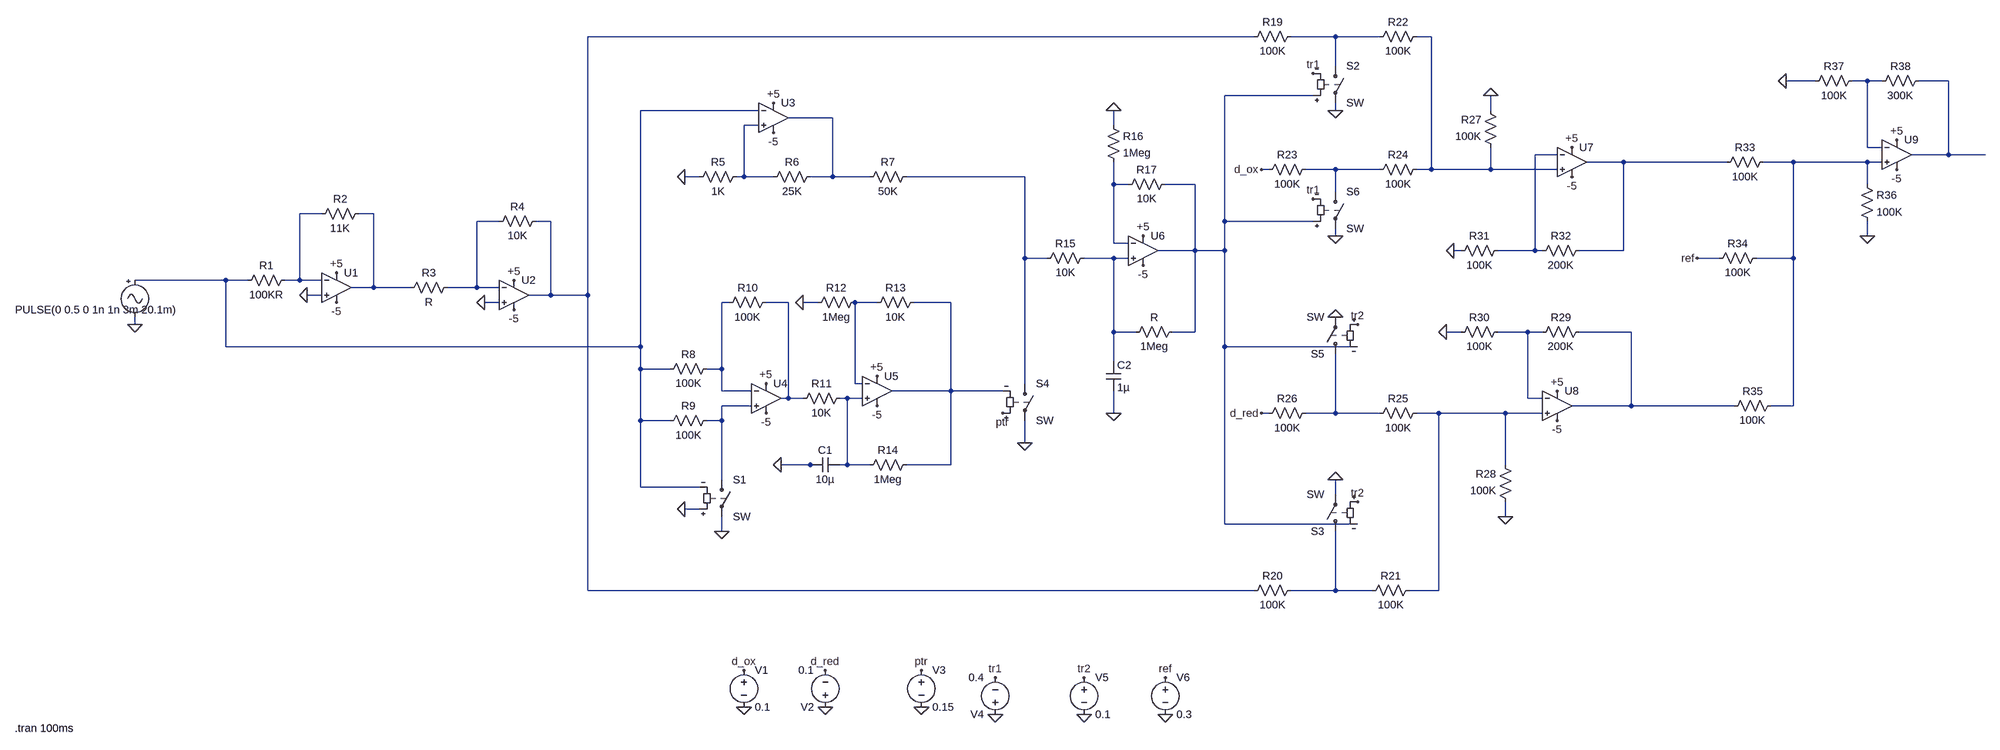
[diagram p0: schematic splitter.asc]
splitter.asc, the LTspice schematic file:
Version 4
SHEET 1 3940 1396
WIRE 2288 -400 688 -400
WIRE 2464 -400 2368 -400
WIRE 2560 -400 2464 -400
WIRE 2672 -400 2640 -400
WIRE 2464 -336 2464 -400
WIRE 3568 -304 3504 -304
WIRE 3680 -304 3648 -304
WIRE 3712 -304 3680 -304
WIRE 3856 -304 3792 -304
WIRE 2416 -272 2224 -272
WIRE 1216 -240 960 -240
WIRE 2464 -240 2464 -256
WIRE 2800 -240 2800 -272
WIRE 1376 -224 1280 -224
WIRE 1216 -208 1184 -208
WIRE 1984 -208 1984 -240
WIRE 3680 -160 3680 -304
WIRE 3712 -160 3680 -160
WIRE 2944 -144 2896 -144
WIRE 3856 -144 3856 -304
WIRE 3856 -144 3776 -144
WIRE 3936 -144 3856 -144
WIRE 3088 -128 3008 -128
WIRE 3376 -128 3088 -128
WIRE 3520 -128 3456 -128
WIRE 3680 -128 3520 -128
WIRE 3712 -128 3680 -128
WIRE 2320 -112 2304 -112
WIRE 2464 -112 2400 -112
WIRE 2560 -112 2464 -112
WIRE 2672 -112 2672 -400
WIRE 2672 -112 2640 -112
WIRE 2800 -112 2800 -160
WIRE 2800 -112 2672 -112
WIRE 2944 -112 2800 -112
WIRE 1088 -96 1056 -96
WIRE 1184 -96 1184 -208
WIRE 1184 -96 1168 -96
WIRE 1248 -96 1184 -96
WIRE 1376 -96 1376 -224
WIRE 1376 -96 1328 -96
WIRE 1456 -96 1376 -96
WIRE 1792 -96 1536 -96
WIRE 1984 -80 1984 -128
WIRE 2016 -80 1984 -80
WIRE 2160 -80 2096 -80
WIRE 3680 -80 3680 -128
WIRE 2464 -64 2464 -112
WIRE 112 -16 64 -16
WIRE 224 -16 192 -16
WIRE 496 0 448 0
WIRE 608 0 576 0
WIRE 2224 0 2224 -272
WIRE 2416 0 2224 0
WIRE 2464 32 2464 16
WIRE 3680 32 3680 0
WIRE 1984 48 1984 -80
WIRE 2016 48 1984 48
WIRE 2160 64 2160 -80
WIRE 2160 64 2080 64
WIRE 2224 64 2224 0
WIRE 2224 64 2160 64
WIRE 2736 64 2720 64
WIRE 2896 64 2896 -144
WIRE 2896 64 2816 64
WIRE 2912 64 2896 64
WIRE 3088 64 3088 -128
WIRE 3088 64 2992 64
WIRE 1792 80 1792 -96
WIRE 1840 80 1792 80
WIRE 1984 80 1920 80
WIRE 2016 80 1984 80
WIRE 3360 80 3312 80
WIRE 3520 80 3520 -128
WIRE 3520 80 3440 80
WIRE -96 128 -384 128
WIRE -48 128 -96 128
WIRE 64 128 64 -16
WIRE 64 128 32 128
WIRE 112 128 64 128
WIRE 224 144 224 -16
WIRE 224 144 176 144
WIRE 304 144 224 144
WIRE 448 144 448 0
WIRE 448 144 384 144
WIRE 496 144 448 144
WIRE 112 160 80 160
WIRE 608 160 608 0
WIRE 608 160 560 160
WIRE 688 160 688 -400
WIRE 688 160 608 160
WIRE 496 176 464 176
WIRE 1152 176 1136 176
WIRE 1280 176 1232 176
WIRE 1344 176 1312 176
WIRE 1472 176 1424 176
WIRE 1632 176 1552 176
WIRE -384 224 -384 208
WIRE 1984 240 1984 80
WIRE 2032 240 1984 240
WIRE 2160 240 2160 64
WIRE 2160 240 2112 240
WIRE 2736 240 2704 240
WIRE 2880 240 2816 240
WIRE 2912 240 2880 240
WIRE 3104 240 2992 240
WIRE -96 272 -96 128
WIRE 960 272 960 -240
WIRE 960 272 -96 272
WIRE 2224 272 2224 64
WIRE 2512 272 2224 272
WIRE 1984 304 1984 240
WIRE 960 320 960 272
WIRE 1024 320 960 320
WIRE 1136 320 1136 176
WIRE 1136 320 1104 320
WIRE 1424 352 1424 176
WIRE 1440 352 1424 352
WIRE 1792 352 1792 80
WIRE 1136 368 1136 320
WIRE 1200 368 1136 368
WIRE 1632 368 1632 176
WIRE 1632 368 1504 368
WIRE 1744 368 1632 368
WIRE 1280 384 1280 176
WIRE 1280 384 1264 384
WIRE 1312 384 1280 384
WIRE 1408 384 1392 384
WIRE 1440 384 1408 384
WIRE 2880 384 2880 240
WIRE 2912 384 2880 384
WIRE 1200 400 1136 400
WIRE 3104 400 3104 240
WIRE 3104 400 2976 400
WIRE 3392 400 3104 400
WIRE 3520 400 3520 80
WIRE 3520 400 3472 400
WIRE 1984 416 1984 368
WIRE 2320 416 2304 416
WIRE 2464 416 2464 288
WIRE 2464 416 2400 416
WIRE 2560 416 2464 416
WIRE 2688 416 2640 416
WIRE 2832 416 2688 416
WIRE 2912 416 2832 416
WIRE 960 432 960 320
WIRE 1024 432 960 432
WIRE 1136 432 1136 400
WIRE 1136 432 1104 432
WIRE 1792 480 1792 432
WIRE 1328 528 1264 528
WIRE 1344 528 1328 528
WIRE 1408 528 1408 384
WIRE 1408 528 1392 528
WIRE 1456 528 1408 528
WIRE 1632 528 1632 368
WIRE 1632 528 1536 528
WIRE 2832 528 2832 416
WIRE 1136 560 1136 432
WIRE 960 576 960 432
WIRE 1088 576 960 576
WIRE 2464 592 2464 560
WIRE 1088 624 1056 624
WIRE 2832 640 2832 608
WIRE 2224 656 2224 272
WIRE 2512 656 2224 656
WIRE 1136 672 1136 640
WIRE 688 800 688 160
WIRE 2288 800 688 800
WIRE 2464 800 2464 672
WIRE 2464 800 2368 800
WIRE 2544 800 2464 800
WIRE 2688 800 2688 416
WIRE 2688 800 2624 800
FLAG 144 112 +5
FLAG 144 176 -5
FLAG 80 160 0
FLAG 528 128 +5
FLAG 528 192 -5
FLAG 464 176 0
FLAG 1248 -256 +5
FLAG 1248 -192 -5
FLAG 1056 -96 0
FLAG 1232 352 +5
FLAG 1232 416 -5
FLAG 1472 336 +5
FLAG 1472 400 -5
FLAG 1312 176 0
FLAG 1264 528 0
FLAG 2048 32 +5
FLAG 2048 96 -5
FLAG 1984 416 0
FLAG 1984 -240 0
FLAG 1056 624 0
FLAG 1136 672 0
FLAG 2464 -240 0
FLAG 2464 560 0
FLAG 1792 480 0
FLAG 2832 640 0
FLAG 2464 208 0
FLAG 2464 32 0
FLAG 2800 -272 0
FLAG 2976 -160 +5
FLAG 2976 -96 -5
FLAG 2944 368 +5
FLAG 2944 432 -5
FLAG 2720 64 0
FLAG 2704 240 0
FLAG 3744 -176 +5
FLAG 3744 -112 -5
FLAG 3680 32 0
FLAG 3504 -304 0
FLAG 1184 1328 0
FLAG 1184 1248 d_ox
FLAG 1360 1328 0
FLAG 1360 1248 d_red
FLAG 1568 1328 0
FLAG 1568 1248 ptr
FLAG 1728 1344 0
FLAG 1728 1264 tr1
FLAG 1920 1344 0
FLAG 1920 1264 tr2
FLAG 2096 1344 0
FLAG 2096 1264 ref
FLAG 1744 416 ptr
FLAG 2512 608 tr2
FLAG 2304 416 d_red
FLAG 2512 224 tr2
FLAG 2416 -48 tr1
FLAG 2304 -112 d_ox
FLAG 2416 -320 tr1
FLAG 3312 80 ref
FLAG -384 224 0
SYMBOL res 48 112 R90
WINDOW 0 0 56 VBottom 2
WINDOW 3 32 56 VTop 2
SYMATTR InstName R1
SYMATTR Value 100KR
SYMBOL Opamps\\UniversalOpamp2 144 144 R0
SYMATTR InstName U1
SYMBOL res 208 -32 R90
WINDOW 0 0 56 VBottom 2
WINDOW 3 32 56 VTop 2
SYMATTR InstName R2
SYMATTR Value 11K
SYMBOL res 400 128 R90
WINDOW 0 0 56 VBottom 2
WINDOW 3 32 56 VTop 2
SYMATTR InstName R3
SYMBOL Opamps\\UniversalOpamp2 528 160 R0
SYMATTR InstName U2
SYMBOL res 592 -16 R90
WINDOW 0 0 56 VBottom 2
WINDOW 3 32 56 VTop 2
SYMATTR InstName R4
SYMATTR Value 10K
SYMBOL Opamps\\UniversalOpamp2 1248 -224 R0
SYMATTR InstName U3
SYMBOL res 1184 -112 R90
WINDOW 0 0 56 VBottom 2
WINDOW 3 32 56 VTop 2
SYMATTR InstName R5
SYMATTR Value 1K
SYMBOL res 1344 -112 R90
WINDOW 0 0 56 VBottom 2
WINDOW 3 32 56 VTop 2
SYMATTR InstName R6
SYMATTR Value 25K
SYMBOL res 1552 -112 R90
WINDOW 0 0 56 VBottom 2
WINDOW 3 32 56 VTop 2
SYMATTR InstName R7
SYMATTR Value 50K
SYMBOL res 1120 304 R90
WINDOW 0 0 56 VBottom 2
WINDOW 3 32 56 VTop 2
SYMATTR InstName R8
SYMATTR Value 100K
SYMBOL res 1120 416 R90
WINDOW 0 0 56 VBottom 2
WINDOW 3 32 56 VTop 2
SYMATTR InstName R9
SYMATTR Value 100K
SYMBOL res 1248 160 R90
WINDOW 0 0 56 VBottom 2
WINDOW 3 32 56 VTop 2
SYMATTR InstName R10
SYMATTR Value 100K
SYMBOL res 1408 368 R90
WINDOW 0 0 56 VBottom 2
WINDOW 3 32 56 VTop 2
SYMATTR InstName R11
SYMATTR Value 10K
SYMBOL Opamps\\UniversalOpamp2 1232 384 R0
SYMATTR InstName U4
SYMBOL Opamps\\UniversalOpamp2 1472 368 R0
SYMATTR InstName U5
SYMBOL res 1440 160 R90
WINDOW 0 0 56 VBottom 2
WINDOW 3 32 56 VTop 2
SYMATTR InstName R12
SYMATTR Value 1Meg
SYMBOL res 1568 160 R90
WINDOW 0 0 56 VBottom 2
WINDOW 3 32 56 VTop 2
SYMATTR InstName R13
SYMATTR Value 10K
SYMBOL res 1552 512 R90
WINDOW 0 0 56 VBottom 2
WINDOW 3 32 56 VTop 2
SYMATTR InstName R14
SYMATTR Value 1Meg
SYMBOL cap 1392 512 R90
WINDOW 0 0 32 VBottom 2
WINDOW 3 32 32 VTop 2
SYMATTR InstName C1
SYMATTR Value 10µ
SYMBOL res 1936 64 R90
WINDOW 0 0 56 VBottom 2
WINDOW 3 32 56 VTop 2
SYMATTR InstName R15
SYMATTR Value 10K
SYMBOL Opamps\\UniversalOpamp2 2048 64 R0
SYMATTR InstName U6
SYMBOL res 1968 -224 R0
SYMATTR InstName R16
SYMATTR Value 1Meg
SYMBOL res 2112 -96 R90
WINDOW 0 0 56 VBottom 2
WINDOW 3 32 56 VTop 2
SYMATTR InstName R17
SYMATTR Value 10K
SYMBOL res 2128 224 R90
WINDOW 0 0 56 VBottom 2
WINDOW 3 32 56 VTop 2
SYMATTR InstName R
SYMATTR Value 1Meg
SYMBOL cap 1968 304 R0
SYMATTR InstName C2
SYMATTR Value 1µ
SYMBOL sw 1136 544 R0
SYMATTR InstName S1
SYMBOL res 2384 -416 R90
WINDOW 0 0 56 VBottom 2
WINDOW 3 32 56 VTop 2
SYMATTR InstName R19
SYMATTR Value 100K
SYMBOL res 2384 784 R90
WINDOW 0 0 56 VBottom 2
WINDOW 3 32 56 VTop 2
SYMATTR InstName R20
SYMATTR Value 100K
SYMBOL res 2640 784 R90
WINDOW 0 0 56 VBottom 2
WINDOW 3 32 56 VTop 2
SYMATTR InstName R21
SYMATTR Value 100K
SYMBOL res 2656 -416 R90
WINDOW 0 0 56 VBottom 2
WINDOW 3 32 56 VTop 2
SYMATTR InstName R22
SYMATTR Value 100K
SYMBOL sw 2464 -352 R0
SYMATTR InstName S2
SYMBOL sw 2464 688 R180
SYMATTR InstName S3
SYMBOL res 2416 -128 R90
WINDOW 0 0 56 VBottom 2
WINDOW 3 32 56 VTop 2
SYMATTR InstName R23
SYMATTR Value 100K
SYMBOL sw 1792 336 R0
SYMATTR InstName S4
SYMBOL sw 2464 304 R180
SYMATTR InstName S5
SYMBOL sw 2464 -80 R0
SYMATTR InstName S6
SYMBOL res 2656 -128 R90
WINDOW 0 0 56 VBottom 2
WINDOW 3 32 56 VTop 2
SYMATTR InstName R24
SYMATTR Value 100K
SYMBOL res 2656 400 R90
WINDOW 0 0 56 VBottom 2
WINDOW 3 32 56 VTop 2
SYMATTR InstName R25
SYMATTR Value 100K
SYMBOL res 2416 400 R90
WINDOW 0 0 56 VBottom 2
WINDOW 3 32 56 VTop 2
SYMATTR InstName R26
SYMATTR Value 100K
SYMBOL res 2816 -144 R180
WINDOW 0 36 76 Left 2
WINDOW 3 36 40 Left 2
SYMATTR InstName R27
SYMATTR Value 100K
SYMBOL res 2848 624 R180
WINDOW 0 36 76 Left 2
WINDOW 3 36 40 Left 2
SYMATTR InstName R28
SYMATTR Value 100K
SYMBOL Opamps\\UniversalOpamp2 2976 -128 R0
SYMATTR InstName U7
SYMBOL Opamps\\UniversalOpamp2 2944 400 R0
SYMATTR InstName U8
SYMBOL res 3008 224 R90
WINDOW 0 0 56 VBottom 2
WINDOW 3 32 56 VTop 2
SYMATTR InstName R29
SYMATTR Value 200K
SYMBOL res 2832 224 R90
WINDOW 0 0 56 VBottom 2
WINDOW 3 32 56 VTop 2
SYMATTR InstName R30
SYMATTR Value 100K
SYMBOL res 2832 48 R90
WINDOW 0 0 56 VBottom 2
WINDOW 3 32 56 VTop 2
SYMATTR InstName R31
SYMATTR Value 100K
SYMBOL res 3008 48 R90
WINDOW 0 0 56 VBottom 2
WINDOW 3 32 56 VTop 2
SYMATTR InstName R32
SYMATTR Value 200K
SYMBOL res 3472 -144 R90
WINDOW 0 0 56 VBottom 2
WINDOW 3 32 56 VTop 2
SYMATTR InstName R33
SYMATTR Value 100K
SYMBOL res 3456 64 R90
WINDOW 0 0 56 VBottom 2
WINDOW 3 32 56 VTop 2
SYMATTR InstName R34
SYMATTR Value 100K
SYMBOL res 3488 384 R90
WINDOW 0 0 56 VBottom 2
WINDOW 3 32 56 VTop 2
SYMATTR InstName R35
SYMATTR Value 100K
SYMBOL Opamps\\UniversalOpamp2 3744 -144 R0
SYMATTR InstName U9
SYMBOL res 3664 -96 R0
SYMATTR InstName R36
SYMATTR Value 100K
SYMBOL res 3664 -320 R90
WINDOW 0 0 56 VBottom 2
WINDOW 3 32 56 VTop 2
SYMATTR InstName R37
SYMATTR Value 100K
SYMBOL res 3808 -320 R90
WINDOW 0 0 56 VBottom 2
WINDOW 3 32 56 VTop 2
SYMATTR InstName R38
SYMATTR Value 300K
SYMBOL voltage 1184 1232 R0
WINDOW 123 0 0 Left 0
WINDOW 39 0 0 Left 0
SYMATTR InstName V1
SYMATTR Value 0.1
SYMBOL voltage 1360 1344 R180
WINDOW 123 0 0 Left 0
WINDOW 39 0 0 Left 0
SYMATTR InstName V2
SYMATTR Value 0.1
SYMBOL voltage 1568 1232 R0
WINDOW 123 0 0 Left 0
WINDOW 39 0 0 Left 0
SYMATTR InstName V3
SYMATTR Value 0.15
SYMBOL voltage 1728 1360 R180
WINDOW 123 0 0 Left 0
WINDOW 39 0 0 Left 0
SYMATTR InstName V4
SYMATTR Value 0.4
SYMBOL voltage 1920 1248 R0
WINDOW 123 0 0 Left 0
WINDOW 39 0 0 Left 0
SYMATTR InstName V5
SYMATTR Value 0.1
SYMBOL voltage 2096 1248 R0
WINDOW 123 0 0 Left 0
WINDOW 39 0 0 Left 0
SYMATTR InstName V6
SYMATTR Value 0.3
SYMBOL Misc\\signal -384 112 R0
WINDOW 0 24 16 Invisible 2
WINDOW 3 -259 80 Left 2
WINDOW 123 0 0 Left 2
WINDOW 39 0 0 Left 2
SYMATTR InstName V7
SYMATTR Value PULSE(0 0.5 0 1n 1n 3m 20.1m)
TEXT -644 1374 Left 2 !.tran 100ms

The netlist it stands for:
* splitter.asc
R1 N016 N007 100KR
XU1 0 N016 +5 -5 N017 level.2 Avol=1Meg GBW=10Meg Slew=10Meg ilimit=25m rail=0 Vos=0 phimargin=45 en=0 enk=0 in=0 ink=0 Rin=500Meg  ; pins IN+ IN- V+ V- OUT
R2 N017 N016 11K
R3 N018 N017 R
XU2 0 N018 +5 -5 N001 level.2 Avol=1Meg GBW=10Meg Slew=10Meg ilimit=25m rail=0 Vos=0 phimargin=45 en=0 enk=0 in=0 ink=0 Rin=500Meg  ; pins IN+ IN- V+ V- OUT
R4 N001 N018 10K
XU3 N009 N007 +5 -5 N008 level.2 Avol=1Meg GBW=10Meg Slew=10Meg ilimit=25m rail=0 Vos=0 phimargin=45 en=0 enk=0 in=0 ink=0 Rin=500Meg  ; pins IN+ IN- V+ V- OUT
R5 N009 0 1K
R6 N008 N009 25K
R7 N014 N008 50K
R8 N020 N007 100K
R9 N027 N007 100K
R10 N021 N020 100K
R11 N026 N021 10K
XU4 N027 N020 +5 -5 N021 level.2 Avol=1Meg GBW=10Meg Slew=10Meg ilimit=25m rail=0 Vos=0 phimargin=45 en=0 enk=0 in=0 ink=0 Rin=500Meg  ; pins IN+ IN- V+ V- OUT
XU5 N026 N022 +5 -5 N023 level.2 Avol=1Meg GBW=10Meg Slew=10Meg ilimit=25m rail=0 Vos=0 phimargin=45 en=0 enk=0 in=0 ink=0 Rin=500Meg  ; pins IN+ IN- V+ V- OUT
R12 N022 0 1Meg
R13 N023 N022 10K
R14 N023 N026 1Meg
C1 N026 0 10µ
R15 N019 N014 10K
XU6 N019 N015 +5 -5 N006 level.2 Avol=1Meg GBW=10Meg Slew=10Meg ilimit=25m rail=0 Vos=0 phimargin=45 en=0 enk=0 in=0 ink=0 Rin=500Meg  ; pins IN+ IN- V+ V- OUT
R16 0 N015 1Meg
R17 N006 N015 10K
R N006 N019 1Meg
C2 N019 0 1µ
S1 N027 0 0 N007 SW
R19 N002 N001 100K
R20 N030 N001 100K
R21 N029 N030 100K
R22 N003 N002 100K
S2 N002 0 N006 tr1 SW
S3 N030 0 tr2 N006 SW
R23 N013 d_ox 100K
S4 N014 0 ptr N023 SW
S5 N028 0 tr2 N006 SW
S6 N013 0 N006 tr1 SW
R24 N003 N013 100K
R25 N029 N028 100K
R26 N028 d_red 100K
R27 N003 0 100K
R28 0 N029 100K
XU7 N003 N010 +5 -5 N011 level.2 Avol=1Meg GBW=10Meg Slew=10Meg ilimit=25m rail=0 Vos=0 phimargin=45 en=0 enk=0 in=0 ink=0 Rin=500Meg  ; pins IN+ IN- V+ V- OUT
XU8 N029 N024 +5 -5 N025 level.2 Avol=1Meg GBW=10Meg Slew=10Meg ilimit=25m rail=0 Vos=0 phimargin=45 en=0 enk=0 in=0 ink=0 Rin=500Meg  ; pins IN+ IN- V+ V- OUT
R29 N025 N024 200K
R30 N024 0 100K
R31 N010 0 100K
R32 N011 N010 200K
R33 N012 N011 100K
R34 N012 ref 100K
R35 N012 N025 100K
XU9 N012 N004 +5 -5 N005 level.2 Avol=1Meg GBW=10Meg Slew=10Meg ilimit=25m rail=0 Vos=0 phimargin=45 en=0 enk=0 in=0 ink=0 Rin=500Meg  ; pins IN+ IN- V+ V- OUT
R36 N012 0 100K
R37 N004 0 100K
R38 N005 N004 300K
V1 d_ox 0 0.1
V2 0 d_red 0.1
V3 ptr 0 0.15
V4 0 tr1 0.4
V5 tr2 0 0.1
V6 ref 0 0.3
V7 N007 0 PULSE(0 0.5 0 1n 1n 3m 20.1m)
.tran 100ms
.lib UniversalOpamps2.sub
.backanno
.end